# Altium schematic sheet TEST_Capteurs_et_Antenne.SchDoc
size A4
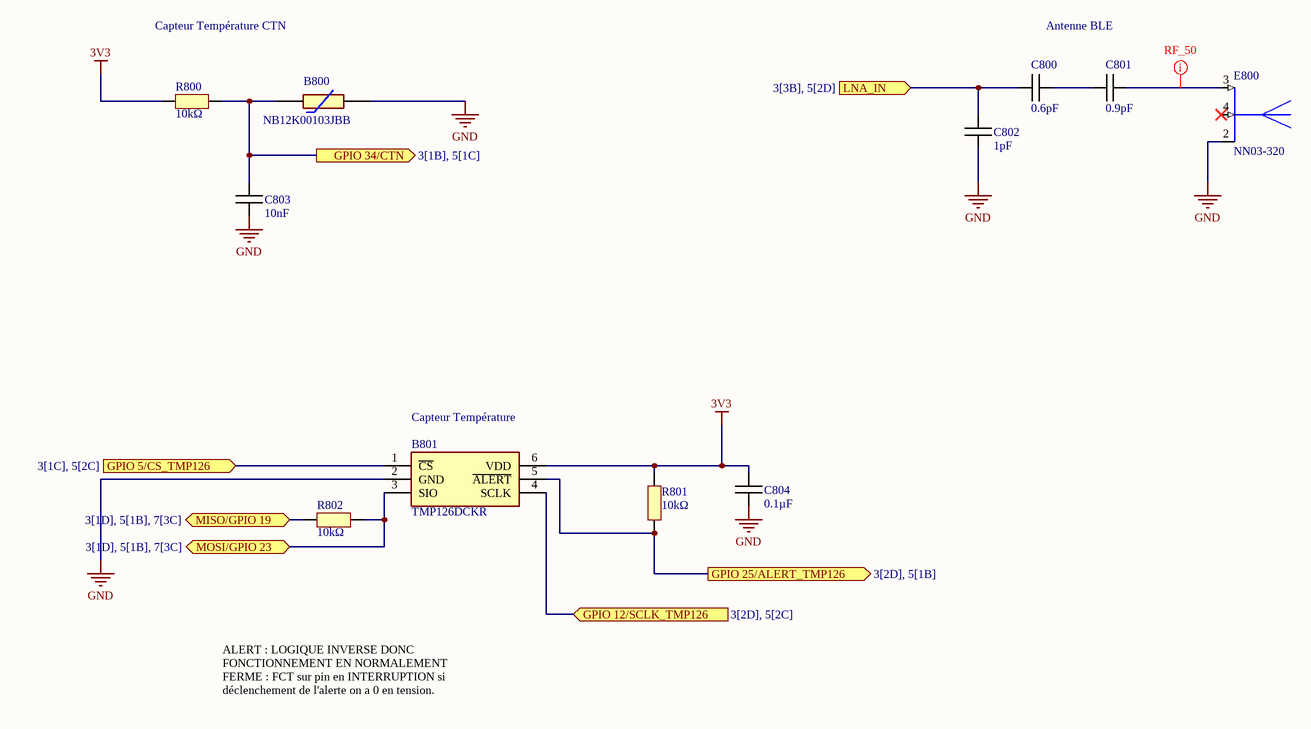
[diagram p0: TEST_Capteurs_et_Antenne.SchDoc]

## Parts
B800  NB12K00103JBB  [RESC2212X50N]
B801  TMP126DCKR  [SOT65P210X110-6N]
C800  0.6pF  [CAPC1005X06N]
C801  0.9pF  [CAPC1005X06N]
C802  1pF  [CAPC1005X06N]
C803  10nF  [CAPC1005X06N]
C804  0.1µF  [CAPC1005X06N]
E800  NN03-320  [XCVR_NN03-320]
R800  10kΩ  [RESC1005X06N]
R801  10kΩ  [RESC1005X06N]
R802  10kΩ  [RESC1005X06N]

## Ports
GPIO 5/CS_TMP126 (in, see 3[1C], 5[2C]), GPIO 12/SCLK_TMP126 (in, see 3[2D], 5[2C]), GPIO 25/ALERT_TMP126 (out, see 3[2D], 5[1B]), GPIO 34/CTN (out, see 3[1B], 5[1C]), LNA_IN (in, see 3[3B], 5[2D]), MISO/GPIO 19 (bidir, see 3[1D], 5[1B], 7[3C]), MOSI/GPIO 23 (bidir, see 3[1D], 5[1B], 7[3C])

## Nets
3V3: B801.6(VDD) C804.1 R800.1 R801.2
GND: B800.2 B801.2(GND) C802.1 C803.2 C804.2 E800.2(GROUND)
GPIO 5/CS_TMP126: B801.1(~{CS}) ; port GPIO 5/CS_TMP126
GPIO 12/SCLK_TMP126: B801.4(SCLK) ; port GPIO 12/SCLK_TMP126
GPIO 25/ALERT_TMP126: B801.5(~{ALERT}) R801.1 ; port GPIO 25/ALERT_TMP126
GPIO 34/CTN: B800.1 C803.1 R800.2 ; port GPIO 34/CTN
LNA_IN: C800.2 C802.2 ; port LNA_IN
MISO/GPIO 19: R802.1 ; port MISO/GPIO 19
MOSI/GPIO 23: B801.3(SIO) R802.2 ; port MOSI/GPIO 23
NetC800_1: C800.1 C801.1
NetC801_2: C801.2 E800.3(FEED_BLUETOOTH)

Not connected (* = marked no-connect by the designer): E800 4(FEED_GNSS)*

## Layout directives
rule Width Constraint [Pref Impedance = 50.00ohms    Min Impedance = 50.00ohms    Max Impedance = 50.00ohms]: NetC801_2

## Notes on the sheet
- Capteur Température CTN
- Antenne BLE
- (near B801) Capteur Température
- ALERT : LOGIQUE INVERSE DONC FONCTIONNEMENT EN NORMALEMENT FERME : FCT sur pin en INTERRUPTION si déclenchement de l'alerte on a 0 en tension.

## Library data of the parts
B800 = NB12K00103JBB: CTN Capteur - NTC SMD Thermistor, NB12K, 10K, 5% AVX 10k 0805 Protection NTC Thermistor, 5s, 2 x 1.25 x 1.3mm; Manufacturer_Name: Kyocera AVX; Geometry.Height: 0.5mm; Manufacturer_Part_Number: NB12K00103JBB; Mouser Part Number: 581-NB12K00103JBB; Mouser Price/Stock: https://www.mouser.co.uk/ProductDetail/AVX/NB12K00103JBB/?qs=4%252B6%252BTdINQeDPvI%252BQUQjJ3Q%3D%3D; Arrow Part Number: NB12K00103JBB; Arrow Price/Stock: https://www.arrow.com/en/products/nb12k00103jbb/avx; Datasheet Link: https://datasheet.datasheetarchive.com/originals/distributors/Datasheets-DGA6/551314.pdf
B801 = TMP126DCKR: Board Mount Temperature Sensors +/-0.25 C SPI temperature sensor with 175 C operation, CRC and slew-rate alert; Manufacturer_Name: Texas Instruments; Manufacturer_Part_Number: TMP126DCKR; Mouser Part Number: 595-TMP126DCKR
C800-C804 = Capacitor
E800 = NN03-320: Dual port antenna booster for GNSS, Bluetooth, 5G and UWB (1561 - 1606MHz, 2400 - 2500MHz, 3400 - 3800MHz, 3100 - 4800MHz and 6000 - 10600 MHz), signal booster; Manufacturer_Name: Ignion; Manufacturer_Part_Number: NN03-320; Mouser Part Number: 128-NN03-320
R800-R802 = Resistor